# EAGLE design Rocketometer2148 MPU9150 No Oscillators Short (EAGLE 6.2)
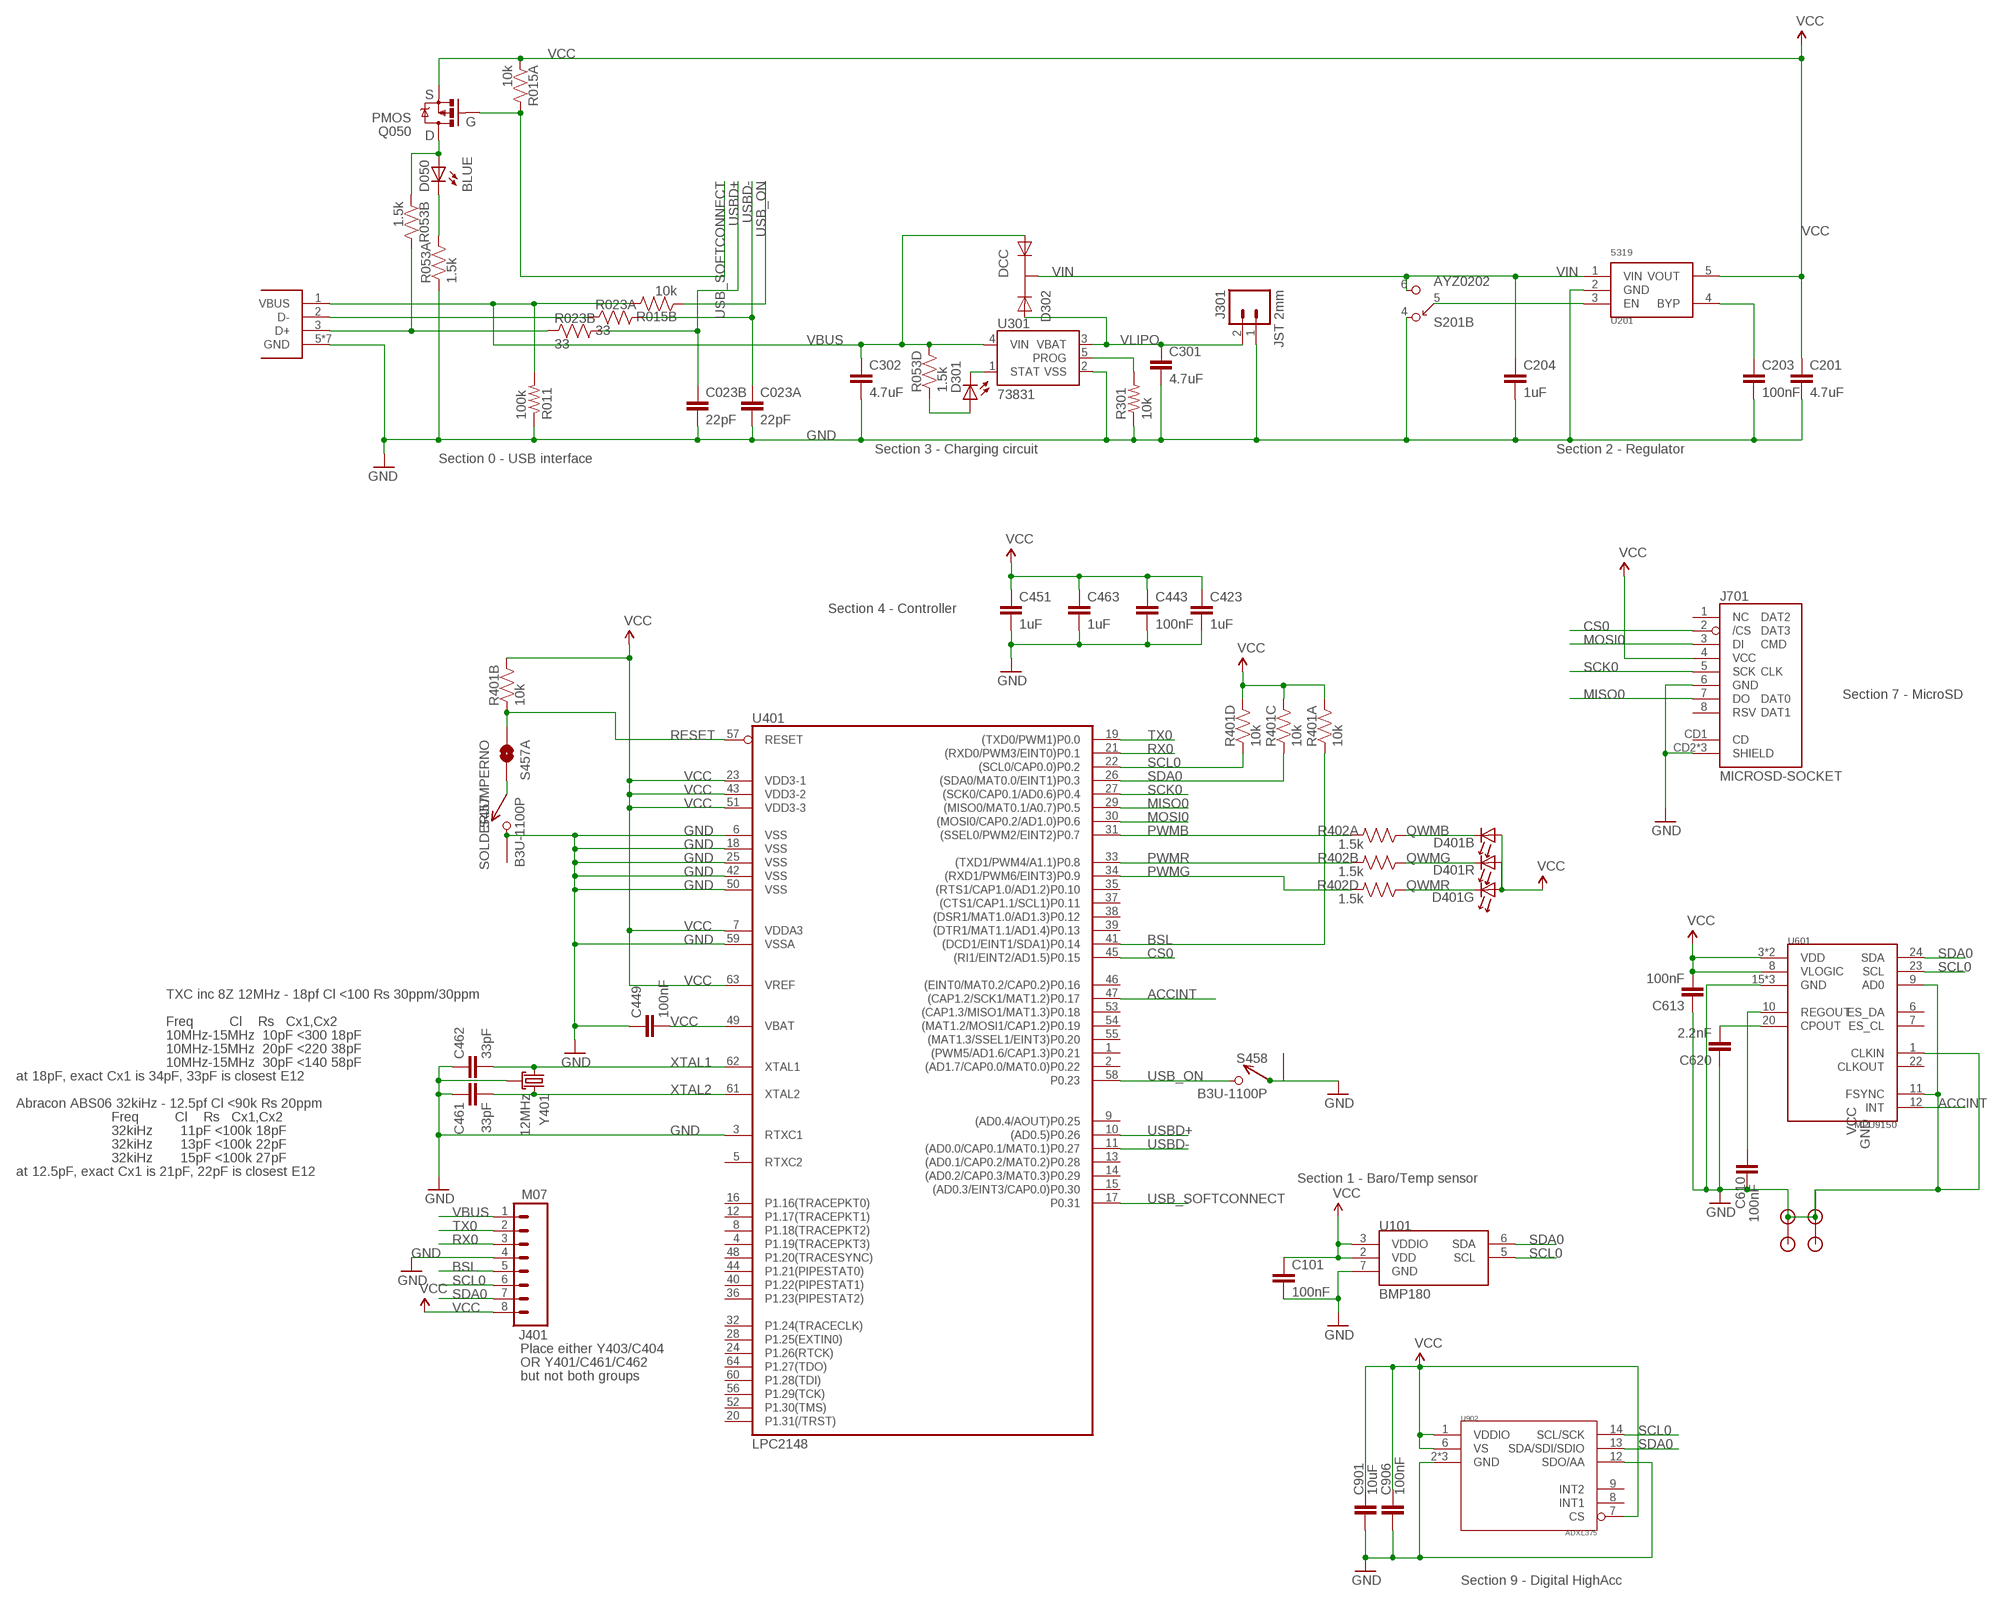
[diagram p0: schematic, sheet 1]

## Parts
C023  22pF  CKCM25  [CKCM25]
C101  100nF  CAP0402-CAP  [0402-CAP]
C201  4.7uF  CAP0402-CAP  [0402-CAP]
C203  100nF  CAP0402-CAP  [0402-CAP]
C204  1uF  CAP0402-CAP  [0402-CAP]
C301  4.7uF  CAP0402-CAP  [0402-CAP]
C302  4.7uF  CAP0402-CAP  [0402-CAP]
C423  1uF  CAP0402-CAP  [0402-CAP]
C443  100nF  CAP0402-CAP  [0402-CAP]
C449  100nF  CAP0402-CAP  [0402-CAP]
C451  1uF  CAP0402-CAP  [0402-CAP]
C461  33pF  CAP0402-CAP  [0402-CAP]
C462  33pF  CAP0402-CAP  [0402-CAP]
C463  1uF  CAP0402-CAP  [0402-CAP]
C610  100nF  CAP0402-CAP  [0402-CAP]
C613  100nF  CAP0402-CAP  [0402-CAP]
C620  2.2nF  CAP0402-CAP  [0402-CAP]
C901  10uF  CAP0603-CAP  [0603-CAP]
C906  100nF  CAP0402-CAP  [0402-CAP]
D050  BLUE  LED0603  [LED-0603]
D301  YELLOW  LED0603  [LED-0603]
D302  DCC  PMEG2005CT  [SOT-23-3]
D401  SMLP36RGB2W(R)  [SMLP36]
J001  USB_MICROB_JSTGCT  [USB_MICROB_3075]
J301  JST 2mm  M02-JST-2MM-SMT  [JST-2-SMD]
J401  M07  M081X08  [1X08]
J701  MICROSD-SOCKET  [MICROSD-SOCKET-PP]
JP1  STANDOFF  [STANDOFF]
JP2  STANDOFF  [STANDOFF]
JP4  STANDOFF  [STANDOFF]
JP5  STANDOFF  [STANDOFF]
Q050  PMOS  MOSFET-PCHANNELSMD  [SOT23-3]
R011  100k  RESISTOR0402-RES  [0402-RES]
R015  10k  RP2EXB24V  [CRA02]
R023  33  RP2EXB24V  [CRA02]
R053  1.5k  RP404  [CRA04]
R301  10k  RESISTOR0402-RES  [0402-RES]
R401  10k  RP404  [CRA04]
R402  1.5k  RP404  [CRA04]
S201  AYZ0202  [AYZ0202]
S457  B3U-1100P  [B3U-1100P]
S457A  SOLDERJUMPERNO  [SJ_2S-NO]
S458  B3U-1100P  [B3U-1100P]
U101  BMP180  [BMP180]
U201  5319  MIC5319D5  [SOT-23-5]
U301  73831  MCP73831  [SOT23-5]
U401  LPC2148  LPC213X  [SQFP-S-10X10-64]
U601  MPU9150  [LLGA24]
U902  ADXL375  [ADXL375]
Y401  12MHz  CX2520  [CRYSTAL_SMD_2MM_2_5MM]

## Nets
ACCINT: U401.47((CAP1.2/SCK1/MAT1.2)P0.17) U601.12(INT)
BSL: J401.5 R401.1 U401.41((DCD1/EINT1/SDA1)P0.14)
CONN_D+: J001.3(D+) R023.2 R053.7
CONN_D-: J001.2(D-) R023.1
CS0: J701.2(/CS) U401.45((RI1/EINT2/AD1.5)P0.15)
EN: S201.5 U201.3(EN)
GND [power]: C023.3 C023.4 C101.2 C201.2 C203.2 C204.2 C301.2 C302.2 C423.2 C443.2 C449.1 C451.2 C461.1 C462.1 C463.2 C610.2 C613.1 C620.1 C901.2 C906.2 J001.5(GND) J001.P$1(GND) J001.P$2(GND) J001.P$3(GND) J001.P$4(GND) J001.P$8(GND) J001.P$10(GND) J301.1 J401.4 J701.6(GND) J701.CD2(SHIELD) J701.GND1(SHIELD) J701.GND3(SHIELD) JP1.P$1 JP2.P$1 JP4.P$1 JP5.P$1 R011.1 R053.1 R301.1 S201.4 S457.P$2 S457.P$3 S458.P$1 S458.P$3 U101.7(GND) U201.2(GND) U301.2(VSS) U401.3(RTXC1) U401.6(VSS) U401.18(VSS) U401.25(VSS) U401.42(VSS) U401.50(VSS) U401.59(VSSA) U601.1(CLKIN) U601.9(AD0) U601.11(FSYNC) U601.15(GND) U601.17(GND) U601.18(GND) U902.2(GND) U902.4(GND) U902.5(GND) U902.12(SDO/AA) Y401.2(GND) Y401.4(GND)
MISO0: J701.7(DO) U401.29((MISO0/MAT0.1/A0.7)P0.5)
MOSI0: J701.3(DI) U401.30((MOSI0/CAP0.2/AD1.0)P0.6)
N$1: C620.2 U601.20(CPOUT)
N$2: R301.2 U301.5(PROG)
N$3: D301.A R053.4
N$4: D301.C U301.1(STAT)
N$6: D050.A Q050.3(D) R053.2
N$7: D050.C R053.8
N$9 [power]: S457.P$1 S457A.2
N$13: C610.1 U601.10(REGOUT)
N$17: C203.1 U201.4(BYP)
PWMB: R402.8 U401.31((SSEL0/PWM2/EINT2)P0.7)
PWMG: R402.5 U401.34((RXD1/PWM6/EINT3)P0.9)
PWMR: R402.7 U401.33((TXD1/PWM4/A1.1)P0.8)
QWMB: D401.1(B:C) R402.1
QWMG: D401.5(G:C) R402.4
QWMR: D401.3(R:C) R402.2
RESET [power]: R401.2 S457A.1 U401.57(RESET)
RX0: J401.3 U401.21((RXD0/PWM3/EINT0)P0.1)
SCK0: J701.5(SCK) U401.27((SCK0/CAP0.1/AD0.6)P0.4)
SCL0: J401.6 R401.4 U101.5(SCL) U401.22((SCL0/CAP0.0)P0.2) U601.23(SCL) U902.14(SCL/SCK)
SDA0: J401.7 R401.3 U101.6(SDA) U401.26((SDA0/MAT0.0/EINT1)P0.3) U601.24(SDA) U902.13(SDA/SDI/SDIO)
TX0: J401.2 U401.19((TXD0/PWM1)P0.0)
USB_ON: R015.2 S458.P$2 U401.58(P0.23)
USB_SOFTCONNECT: Q050.1(G) R015.4 U401.17(P0.31)
USBD+: C023.2 R023.3 U401.10((AD0.5)P0.26)
USBD-: C023.1 R023.4 U401.11((AD0.0/CAP0.1/MAT0.1)P0.27)
VBUS [power]: C302.1 D302.1(A1) J001.1(VBUS) J401.1 R011.2 R015.3 R053.5 U301.4(VIN)
VCC [power]: C101.1 C201.1 C423.1 C443.1 C449.2 C451.1 C463.1 C613.2 C901.1 C906.1 D401.2(B:A) D401.4(R:A) D401.6(G:A) J401.8 J701.4(VCC) Q050.2(S) R015.1 R401.5 R401.6 R401.7 R401.8 U101.2(VDD) U101.3(VDDIO) U201.5(VOUT) U401.7(VDDA3) U401.23(VDD3-1) U401.43(VDD3-2) U401.49(VBAT) U401.51(VDD3-3) U401.63(VREF) U601.3(VDD) U601.8(VLOGIC) U601.13(VDD) U902.1(VDDIO) U902.6(VS) U902.7(CS)
VIN: C204.1 D302.3(K) S201.6 U201.1(VIN)
VLIPO [power]: C301.1 D302.2(A2) J301.2 U301.3(VBAT)
XTAL1: C462.2 U401.62(XTAL1) Y401.1
XTAL2: C461.2 U401.61(XTAL2) Y401.3
Unconnected: J701.1(NC) J701.8(RSV) J701.CD1(CD) R053.3 R053.6 R402.3 R402.6 S201.1 S201.2 S201.3 U401.1((PWM5/AD1.6/CAP1.3)P0.21) U401.2((AD1.7/CAP0.0/MAT0.0)P0.22) U401.4(P1.19(TRACEPKT3)) U401.5(RTXC2) U401.8(P1.18(TRACEPKT2)) U401.9((AD0.4/AOUT)P0.25) U401.12(P1.17(TRACEPKT1)) U401.13((AD0.1/CAP0.2/MAT0.2)P0.28) U401.14((AD0.2/CAP0.3/MAT0.3)P0.29) U401.15((AD0.3/EINT3/CAP0.0)P0.30) U401.16(P1.16(TRACEPKT0)) U401.20(P1.31(/TRST)) U401.24(P1.26(RTCK)) U401.28(P1.25(EXTIN0)) U401.32(P1.24(TRACECLK)) U401.35((RTS1/CAP1.0/AD1.2)P0.10) U401.36(P1.23(PIPESTAT2)) U401.37((CTS1/CAP1.1/SCL1)P0.11) U401.38((DSR1/MAT1.0/AD1.3)P0.12) U401.39((DTR1/MAT1.1/AD1.4)P0.13) U401.40(P1.22(PIPESTAT1)) U401.44(P1.21(PIPESTAT0)) U401.46((EINT0/MAT0.2/CAP0.2)P0.16) U401.48(P1.20(TRACESYNC)) U401.52(P1.30(TMS)) U401.53((CAP1.3/MISO1/MAT1.3)P0.18) U401.54((MAT1.2/MOSI1/CAP1.2)P0.19) U401.55((MAT1.3/SSEL1/EINT3)P0.20) U401.56(P1.29(TCK)) U401.60(P1.28(TDI)) U401.64(P1.27(TDO)) U601.6(ES_DA) U601.7(ES_CL) U601.22(CLKOUT) U902.8(INT1) U902.9(INT2)

## Notes on the sheet
- S
- G
- D
- Section 0 - USB interface | Section 3 - Charging circuit | Section 2 - Regulator
- Section 4 - Controller
- Section 7 - MicroSD
- TXC inc 8Z 12MHz - 18pf Cl <100 Rs 30ppm/30ppm
- Freq         Cl    Rs   Cx1,Cx2
- 10MHz-15MHz  10pF <300 18pF
- 10MHz-15MHz  20pF <220 38pF
- 10MHz-15MHz  30pF <140 58pF
- at 18pF, exact Cx1 is 34pF, 33pF is closest E12
- Abracon ABS06 32kiHz - 12.5pf Cl <90k Rs 20ppm
- Freq         Cl    Rs   Cx1,Cx2
- 32kiHz       11pF <100k 18pF
- 32kiHz       13pF <100k 22pF
- 32kiHz       15pF <100k 27pF
- at 12.5pF, exact Cx1 is 21pF, 22pF is closest E12
- Section 1 - Baro/Temp sensor
- Place either Y403/C404
- OR Y401/C461/C462
- but not both groups
- Section 9 - Digital HighAcc

## Library data of the parts
C023 = KwanSystems:CKC; DIGIKEY: 445-1860-1-ND
C101 C203 C443 C449 C610 C613 = SparkFun:CAP: Capacitor Standard 0603 ceramic capacitor, and 0.1" leaded capacitor.; DIGIKEY: 445-1265-1-ND
C201 C301 C302 = SparkFun:CAP: Capacitor Standard 0603 ceramic capacitor, and 0.1" leaded capacitor.; DIGIKEY: 445-7395-1-ND
C204 C423 C451 C463 = SparkFun:CAP: Capacitor Standard 0603 ceramic capacitor, and 0.1" leaded capacitor.; DIGIKEY: 445-4114-1-ND
C461 C462 = SparkFun:CAP: Capacitor Standard 0603 ceramic capacitor, and 0.1" leaded capacitor.; DIGIKEY: 445-1241-1-ND
C620 = SparkFun:CAP: Capacitor Standard 0603 ceramic capacitor, and 0.1" leaded capacitor.; DIGIKEY: 445-1257-1-ND
C901 = SparkFun:CAP: Capacitor Standard 0603 ceramic capacitor, and 0.1" leaded capacitor.; DIGIKEY: 445-7486-1-ND
C906 = SparkFun-Passives:CAP: Capacitor Standard 0603 ceramic capacitor, and 0.1" leaded capacitor.; DIGIKEY: 445-1265-1-ND
D050 = SparkFun:LED: LEDs Standard schematic elements and footprints for 5mm, 3mm, 1206, and 0603 sized LEDs. 5mm - Spark Fun Electronics SKU : COM-00529 (and others); DIGIKEY: 350-2037-1-ND
D301 = SparkFun:LED: LEDs Standard schematic elements and footprints for 5mm, 3mm, 1206, and 0603 sized LEDs. 5mm - Spark Fun Electronics SKU : COM-00529 (and others); DIGIKEY: 350-2032-1-ND
D302 = KwanSystems:PMEG2005CT; DIGIKEY: 568-6500-1-ND
D401 = KwanSystems:SMLP36RGB2W(R); DIGIKEY: 846-1097-1-ND
J001 = KwanSystems:USB_MICROB_JST; DIGIKEY: 609-4616-2-ND
J301 = SparkFun:M02: Header 2 Standard 2-pin 0.1" header. Use with straight break away headers (SKU : PRT-00116), right angle break away headers (PRT-00553), swiss pins (PRT-00743), machine pins (PRT-00117), and female headers (PRT-00115). Molex polarized connector foot print use with SKU : PRT-08233 with associated crimp pins and housings.; DIGIKEY: 455-1749-1-ND
J401 = SparkFun-Connectors:M08: Header 8 Standard 8-pin 0.1" header. Use with straight break away headers (SKU : PRT-00116), right angle break away headers (PRT-00553), swiss pins (PRT-00743), machine pins (PRT-00117), and female headers (PRT-00115).; DIGIKEY: $NOPART
J701 = KwanSystems:MICROSD-SOCKET: microSD Socket Push-push type uSD socket. Digikey 101-00660-68-6-1-ND. tDoc lines correctly indicate media card edge positions when inserting (unlocked, locked, depressed).; DIGIKEY: 101-00581-59-1-ND
JP1 JP2 JP4 JP5 = KwanSystems:STANDOFF; DIGIKEY: $NOPART
Q050 = SparkFun:MOSFET-PCHANNEL; DIGIKEY: NTR1P02T1GOSCT-ND
R011 = SparkFun:RESISTOR: Resistor Basic schematic elements and footprints for 0603, 1206, and PTH resistors.; DIGIKEY: P100KLCT-ND
R015 = KwanSystems:RP2; DIGIKEY: Y5103CT-ND
R023 = KwanSystems:RP2
R053 R402 = KwanSystems:RP4; DIGIKEY: CRA4S81.5KCT-ND
R301 = SparkFun:RESISTOR: Resistor Basic schematic elements and footprints for 0603, 1206, and PTH resistors.; DIGIKEY: P10.0KLCT-ND
R401 = KwanSystems:RP4; DIGIKEY: CRA4S810KCT-ND
S201 = KwanSystems:AYZ0202; DIGIKEY: 401-2013-1-ND
S457 S458 = KwanSystems:B3U-1100P; DIGIKEY: SW1021CT-ND
S457A = SparkFun-Passives:SOLDERJUMPER: Solder Jumper Standard SMD solder jumper. Used to automate production. Two varients : Normally Open and Normally Closed are the same, but have different paste layers. NC will have a large amount of paste and should jumper during reflow.; DIGIKEY: $NOPART
U101 = KwanSystems:BMP180; DIGIKEY: 828-1027-1-ND
U201 = KwanSystems:MIC5319; DIGIKEY: 576-1910-1-ND
U301 = SparkFun:MCP73831: Microchip's MCP73831 Miniature single cell, fully integrated Li-Ion, Li-polymer charge management controller http://ww1.microchip.com/downloads/en/DeviceDoc/21984a.pdf; DIGIKEY: MCP73831T-2ACI/OTCT-ND
U401 = SparkFun:LPC213X: LPC213x Schematic element and footprint for NXP LPC213x. Spark Fun Electronics SKU : COM-00520; DIGIKEY: 568-1765-ND
U601 = KwanSystems:MPU9150; DIGIKEY: $NOPART
U902 = KwanSystems:ADXL375; DIGIKEY: ADXL375BCCZ-ND
Y401 = KwanSystems:CX2520; DIGIKEY: 887-1487-1-ND

## Net classes
0 default: width 0.152 mm, drill 0.33 mm, clearance 0.152 mm
1 power: width 0.152 mm, drill 0.33 mm, clearance 0.152 mm to class 0, clearance 0.152 mm
2 hv: width 0.152 mm, drill 0.33 mm, clearance 0.152 mm to class 0, clearance 0.152 mm to class 1, clearance 0.152 mm

## Board
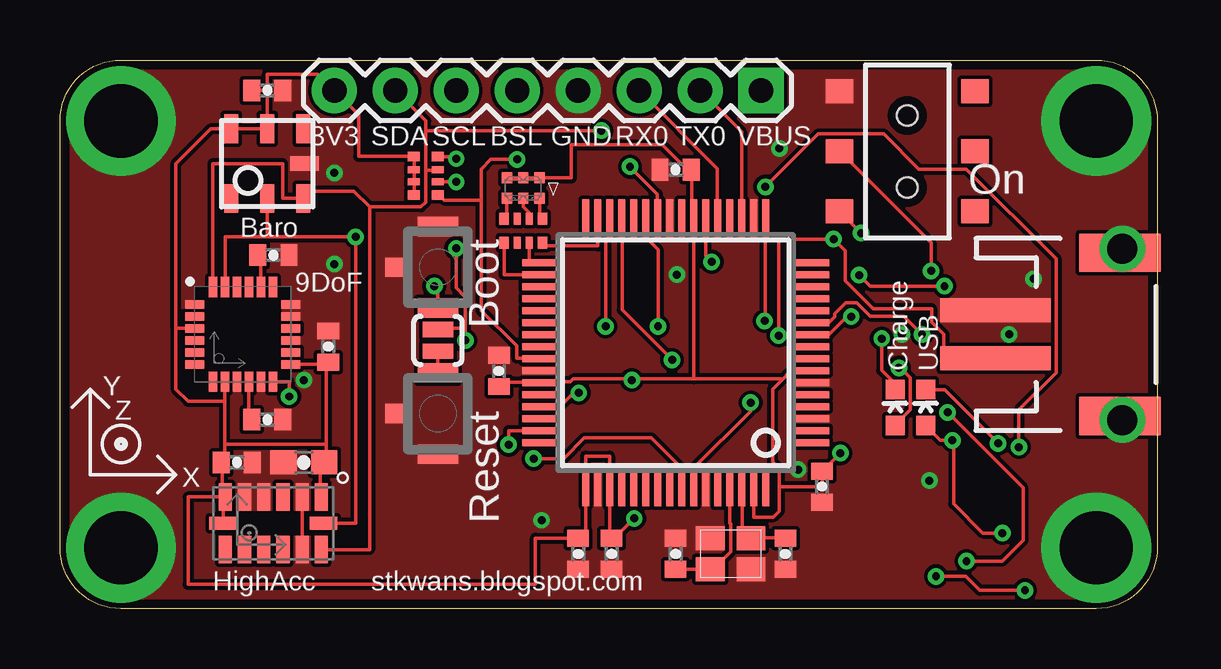
[diagram p1: board, top side]
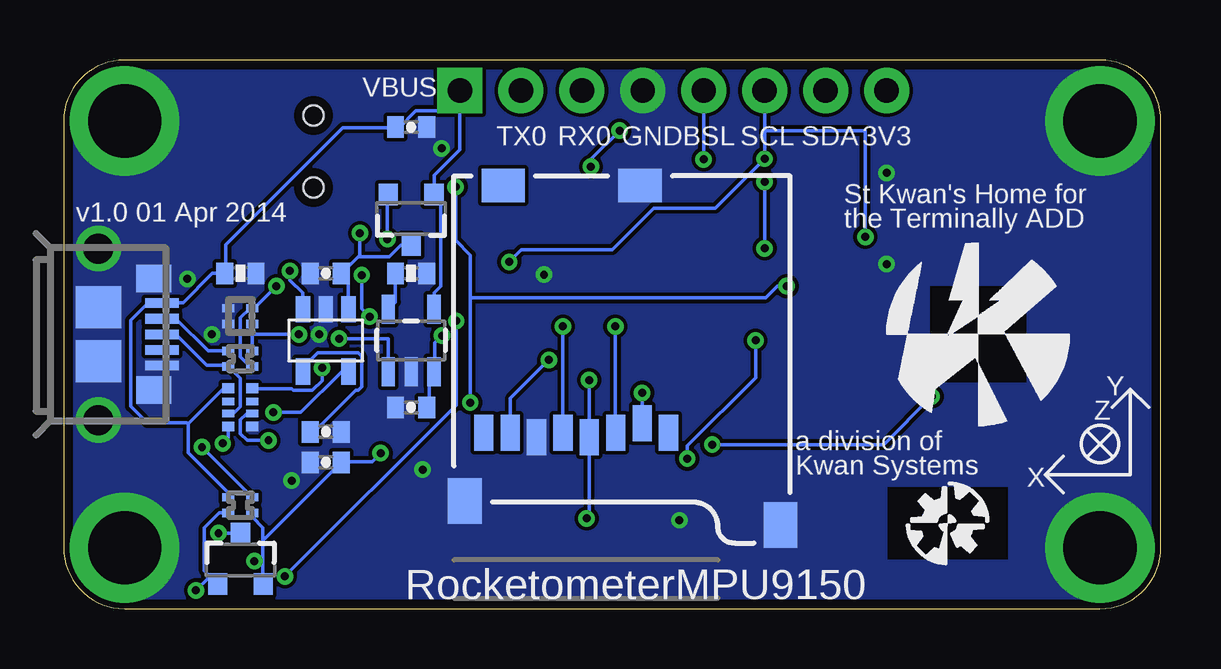
[diagram p2: board, bottom side, seen from below]

Size 45.72 x 22.86 mm. Coordinates in mm from the lower left corner, seen from the top.
Outline: 2.54,22.86 43.18,22.86 arc-90 45.72,20.32 45.72,2.54 arc-90 43.18,0 2.54,0 arc-90 0,2.54 0,20.32 arc-90 2.54,22.86
Copper layers (1*16): Top 0.0356mm / dielectric 1.5011mm / Bottom 0.0356mm
Design rules: minimum track width 6mil, minimum drill 13mil, track to track 6mil, track to pad 6mil, pad to pad 6mil, via to via 6mil, smd to smd 6mil, copper to edge 15mil, drill to drill 6mil, minimum pad ring 7mil, minimum via ring 7mil, stop-mask expansion 4mil, vias tented up to drill 14mil, thermal gap 10mil

### Footprints (pad centres in the part's own frame; a part is rotated, then mirrored left to right if it is on the bottom)
CKCM25 = smd 0.35 x 0.5: 1 -0.325,-0.5; 2 0.325,-0.5; 3 0.325,0.5; 4 -0.325,0.5
0402-CAP = smd 0.7 x 0.9: 1 -0.65,0; 2 0.65,0
0603-CAP = smd 1.1 x 1: 1 -0.85,0; 2 0.85,0
LED-0603 = smd 0.8 x 0.8: A 0,-0.75; C 0,0.75
SOT-23-3 = smd 0.9 x 0.8: 1 -1,0.95; 2 -1,-0.95; 3 1.1,0
SMLP36 = smd 0.45 x 0.45: 1 -0.675,0.425; 2 -0.675,-0.425; 5 0.675,0.425; 6 0.675,-0.425 | smd 0.4 x 0.45: 3 0,0.425; 4 0,-0.425
USB_MICROB_3075 = smd 0.4 x 1.4: 1 -1.3,4.1; 2 -0.65,4.1; 3 0,4.1; 4 0.65,4.1; 5 1.3,4.1 | smd 1.15 x 1.45: P$1 2.32,3.75; P$10 -2.32,3.75 | smd 1.75 x 1.9: P$2 1.125,1.45; P$8 -1.125,1.45 | drill 1.25 pad 1.9: P$3 -3.575,1.45; P$4 3.575,1.45
JST-2-SMD = smd 1 x 4.6: 1 -1,-3.7; 2 1,-3.7 | smd 1.6 x 3.4: NC1 -3.4,1.5; NC2 3.4,1.5
1X08 = drill 1.016 pad 1.88 square: 1 0,0 | drill 1.016 pad 1.88: 2 2.54,0; 3 5.08,0; 4 7.62,0; 5 10.16,0; 6 12.7,0; 7 15.24,0; 8 17.78,0
MICROSD-SOCKET-PP = smd 0.8 x 1.5: 1 -8.94,10.7; 2 -7.84,10.3; 3 -6.74,10.7; 4 -5.64,10.9; 5 -4.54,10.7; 6 -3.44,10.9; 7 -2.34,10.7; 8 -1.24,10.7 | smd 1.8 x 1.4: CD1 -2.05,0.4; CD2 -7.75,0.4 | smd 1.4 x 1.9: GND1 -13.6,14.55; GND3 -0.45,13.55
STANDOFF = drill 3.048 pad 4.572: P$1 0,0
SOT23-3 = smd 0.8 x 0.9: 1 -0.95,-1; 2 0.95,-1; 3 0,1.1
0402-RES = smd 0.7 x 0.9: 1 -0.65,0; 2 0.65,0
CRA02 = smd 0.35 x 0.5: 1 -0.325,-0.5; 2 0.325,-0.5; 3 0.325,0.5; 4 -0.325,0.5
CRA04 = smd 0.4 x 0.5: 1 -0.8,-0.5; 4 0.8,-0.5; 5 0.8,0.5; 8 -0.8,0.5 | smd 0.3 x 0.5: 2 -0.25,-0.5; 3 0.25,-0.5; 6 0.25,0.5; 7 -0.25,0.5
AYZ0202 = smd 1 x 1.15: 1 -2.5,2.825; 2 0,2.825; 3 2.5,2.825; 4 -2.5,-2.825; 5 0,-2.825; 6 2.5,-2.825 | hole 0.85: 1.5,0; -1.5,0
B3U-1100P = smd 0.8 x 1.7: P$1 -1.7,0; P$2 1.7,0 | smd 0.8 x 1.1: P$3 0,-1.65
SJ_2S-NO = smd 0.635 x 1.27: 1 -0.45,0; 2 0.45,0
BMP180 = smd 0.6 x 1.2: 1 1.5,1.45; 2 0,1.45; 3 -1.5,1.45; 4 -1.5,-1.45; 5 0,-1.45; 6 1.5,-1.45 | smd 1.2 x 0.6: 7 1.55,0
SOT-23-5 = smd 0.6 x 1.1: 1 -0.95,-1.3; 2 0,-1.3; 3 0.95,-1.3; 4 0.95,1.3; 5 -0.95,1.3
SOT23-5 = smd 0.55 x 1.2: 1 -0.95,-1.3; 2 0,-1.3; 3 0.95,-1.3; 4 0.95,1.3; 5 -0.95,1.3
SQFP-S-10X10-64 = smd 0.3 x 1.6: 1 -3.75,-5.6; 2 -3.25,-5.6; 3 -2.75,-5.6; 4 -2.25,-5.6; 5 -1.75,-5.6; 6 -1.25,-5.6; 7 -0.75,-5.6; 8 -0.25,-5.6; 9 0.25,-5.6; 10 0.75,-5.6; 11 1.25,-5.6; 12 1.75,-5.6; 13 2.25,-5.6; 14 2.75,-5.6; 15 3.25,-5.6; 16 3.75,-5.6; 33 3.75,5.6; 34 3.25,5.6; 35 2.75,5.6; 36 2.25,5.6; 37 1.75,5.6; 38 1.25,5.6; 39 0.75,5.6; 40 0.25,5.6; 41 -0.25,5.6; 42 -0.75,5.6; 43 -1.25,5.6; 44 -1.75,5.6; 45 -2.25,5.6; 46 -2.75,5.6; 47 -3.25,5.6; 48 -3.75,5.6 | smd 1.6 x 0.3: 17 5.6,-3.75; 18 5.6,-3.25; 19 5.6,-2.75; 20 5.6,-2.25; 21 5.6,-1.75; 22 5.6,-1.25; 23 5.6,-0.75; 24 5.6,-0.25; 25 5.6,0.25; 26 5.6,0.75; 27 5.6,1.25; 28 5.6,1.75; 29 5.6,2.25; 30 5.6,2.75; 31 5.6,3.25; 32 5.6,3.75; 49 -5.6,3.75; 50 -5.6,3.25; 51 -5.6,2.75; 52 -5.6,2.25; 53 -5.6,1.75; 54 -5.6,1.25; 55 -5.6,0.75; 56 -5.6,0.25; 57 -5.6,-0.25; 58 -5.6,-0.75; 59 -5.6,-1.25; 60 -5.6,-1.75; 61 -5.6,-2.25; 62 -5.6,-2.75; 63 -5.6,-3.25; 64 -5.6,-3.75
LLGA24 = smd 0.8 x 0.35: 1 -2,1.25; 2 -2,0.75; 3 -2,0.25; 4 -2,-0.25; 5 -2,-0.75; 6 -2,-1.25; 13 2,-1.25; 14 2,-0.75; 15 2,-0.25; 16 2,0.25; 17 2,0.75; 18 2,1.25 | smd 0.35 x 0.85: 7 -1.25,-1.975; 8 -0.75,-1.975; 9 -0.25,-1.975; 10 0.25,-1.975; 11 0.75,-1.975; 12 1.25,-1.975; 19 1.25,1.975; 20 0.75,1.975; 21 0.25,1.975; 22 -0.25,1.975; 23 -0.75,1.975; 24 -1.25,1.975
ADXL375 = smd 0.55 x 1.145: 1 2,1.097; 2 1.2,1.097; 3 0.4,1.097; 4 -0.4,1.097; 5 -1.2,1.097; 6 -2,1.097; 8 -2,-1.097; 9 -1.2,-1.097; 10 -0.4,-1.097; 11 0.4,-1.097; 12 1.2,-1.097; 13 2,-1.097 | smd 1.145 x 0.55: 7 -2.098,0; 14 2.098,0
CRYSTAL_SMD_2MM_2_5MM = smd 1.2 x 1: 1 -0.85,-0.65; 2 0.85,-0.65; 3 0.85,0.65; 4 -0.85,0.65

### Placement (x,y rotation side)
C023  38.35,12.19 90 bottom
C101  8.64,21.59 0 top
C201  34.8,6.1 180 bottom
C203  34.8,7.37 0 bottom
C204  34.8,13.97 180 bottom
C301  31.24,8.38 180 bottom
C302  31.24,20.07 0 bottom
C423  25.65,18.29 180 top
C443  18.29,9.91 90 top
C449  21.59,2.29 90 top
C451  22.99,2.29 270 top
C461  25.65,2.29 270 top
C462  30.23,2.29 90 top
C463  31.75,5.08 270 top
C610  8.64,7.87 0 top
C613  11.18,10.92 270 top
C620  8.89,14.73 180 top
C901  10.16,6.1 180 top
C906  7.37,6.1 0 top
D050  36.07,8.38 0 top
D301  34.8,8.38 0 top
D302  31.24,16.26 270 bottom
D401  19.3,17.53 180 top
J001  45.72,11.43 270 bottom
J301  42.67,11.43 270 top
J401  29.21,21.59 180 top
J701  29.46,18.03 180 bottom
JP1  2.54,2.54 0 top
JP2  2.54,20.32 0 top
JP4  43.18,2.54 0 top
JP5  43.18,20.32 0 top
Q050  38.35,2.03 0 bottom
R011  38.35,13.97 180 bottom
R015  38.35,4.32 90 bottom
R023  38.35,10.41 270 bottom
R053  38.35,8.38 90 bottom
R301  31.24,13.97 180 bottom
R401  15.24,18.03 90 top
R402  19.3,15.75 180 top
S201  35.31,19.05 270 top
S457  15.75,8.13 270 top
S457A  15.75,11.18 270 top
S458  15.75,14.22 270 top
U101  8.64,18.54 0 top
U201  34.8,11.18 180 bottom
U301  31.24,11.18 0 bottom
U401  25.65,10.67 90 top
U601  7.62,11.43 0 top
U902  8.89,3.56 0 top
U$4  [AXES]  1.27,5.59 0 top
U$5  [KWAN_ACC]  7.62,11.43 0 bottom
U$6  [OSHW_ACC]  8.89,3.56 0 bottom
Y401  27.94,2.29 180 top

### Tracks (layer width: path | path; a pad name or v marks a point on that pad's centre or on a via)
ACCINT  (via drill 0.33)
  Top 0.152: U401.47 18.69,7.42 v18.69,6.83 | U601.12 9.55,9.46 v9.55,8.84
  Bottom 0.152: v9.55,8.84 11.56,6.83 v18.69,6.83
BSL  (via drill 0.33)
  Top 0.152: 17.55,17.02 17.55,12.42 19.02,10.95 19.02,10.44 20.04,10.44 U401.41 | 17.55,17.02 17.55,18.31 17.96,18.72 v19.05,18.72 | R401.1 15.8,17.22 16,17.02 17.55,17.02
  Bottom 0.152: v19.05,18.72 J401.5
CONN_D+
  Bottom 0.152: R053.7 38.84,8.15 38.61,8.15 38.35,8.41 38.35,9.6 38.84,10.08 R023.2 38.91,10.13 39.75,10.13 41.05,11.43 J001.3
CONN_D-
  Bottom 0.152: R023.1 38.86,10.74 39.7,10.74 41.02,12.06 41.6,12.06 J001.2
CS0  (via drill 0.33)
  Top 0.152: v21.61,8.99 21.41,8.99 20.85,8.43 20.07,8.43 U401.45
  Bottom 0.152: v21.61,8.99 21.61,7.75 J701.2
EN  (via drill 0.33)
  Top 0.152: v36.3,14.07 36.3,15.24 S201.5
  Bottom 0.152: v36.3,14.07 36.3,13.69 35.76,13.16 35.76,12.5 U201.3
GND  (via drill 0.33)
  Top 0.152: U601.1 | 31.27,7.9 U401.3 | U902.2 U902.12
  other vias: 35.08,11.43 39.55,11.43 29.97,19.18 40.56,13.74 36.22,5.33 25.7,13.92 30.76,5.79 11.43,14.35 10.16,9.53 11.43,18.16 20.07,3.68
  pour Bottom (no thermals): 2.54,22.86 43.18,22.86 arc-90 45.72,20.32 45.72,2.54 arc-90 43.18,0 2.54,0 arc-90 0,2.54 0,20.32 arc-90
  pour Top (no thermals): 2.54,22.86 43.18,22.86 arc-90 45.72,20.32 45.72,2.54 arc-90 43.18,0 2.54,0 arc-90 0,2.54 0,20.32 arc-90
MISO0  (via drill 0.33)
  Top 0.152: v25.5,10.36 23.42,12.45 23.42,16.26 U401.29
  Bottom 0.152: v25.5,10.36 27.1,8.76 27.1,7.34 J701.7
MOSI0  (via drill 0.33)
  Top 0.152: v22.73,11.76 22.73,15.32 22.89,15.47 22.89,16.26 U401.30
  Bottom 0.152: v22.73,11.76 22.73,7.34 J701.3
N$1
  Top 0.152: U601.20 8.36,13.41 8.36,14.63 8.26,14.73 C620.2
N$2
  Bottom 0.152: R301.2 31.9,13.97 31.9,12.78 32.18,12.5 U301.5
N$3  (via drill 0.33)
  Top 0.152: v34.95,10.03 35.03,10.03 35.43,9.63 35.43,8.28 34.8,7.64 D301.A
  Bottom 0.152: v34.95,10.03 34.95,9.5 35.36,9.09 36.14,9.09 36.22,9.17 R053.4
N$4  (via drill 0.33)
  Top 0.152: D301.C 34.8,9.37 34.24,9.93 v34.24,11.25
  Bottom 0.152: 32.21,9.88 U301.1 32.19,11.25 v34.24,11.25
N$6  (via drill 0.33)
  Top 0.152: D050.A 36.68,7.01 v37.19,7.01 37.24,6.96 37.24,4.37 38.46,3.15 v39.27,3.15
  Bottom 0.152: v37.19,7.01 38.08,7.01 38.35,7.29 38.35,7.87 38.1,8.13 37.87,8.13 R053.2 | v39.27,3.15 38.35,3.15 Q050.3
N$7  (via drill 0.33)
  Top 0.152: v39.09,6.88 36.85,9.12 36.07,9.12 D050.C
  Bottom 0.152: v39.09,6.88 38.86,7.11 38.86,7.57 R053.8
N$9
  Top 0.152: S457.P$1 S457A.2
N$13
  Top 0.152: U601.10 7.87,7.98 7.98,7.87 C610.1
N$17
  Bottom 0.152: C203.1 35.28,7.37 33.55,9.09 33.45,9.09 33.3,9.25 33.3,10.52 33.45,10.67 35.13,10.67 35.74,10.06 35.74,9.88 U201.4
PWMB
  Top 0.152: U401.31 22.4,15.11 20.24,15.11 R402.8
PWMG
  Top 0.152: U401.34 18.5,13.92 R402.5
PWMR
  Top 0.152: U401.33 19.55,14.42 R402.7
QWMB
  Top 0.152: D401.1 19.99,16.36 R402.1
QWMG
  Top 0.152: D401.5 18.62,17.09 18.62,16.36 18.52,16.26 R402.4
QWMR
  Top 0.152: D401.3 19.3,16.74 19.53,16.51 19.53,16.26 R402.2
RESET  (via drill 0.33)
  Top 0.152: v16.51,17.78 R401.2 | v16.51,15.01 16.51,13.36 16.89,12.98 16.89,11.68 | S457A.1 15.81,11.68 16.89,11.68 | U401.57 25.88,5.08 25.88,5.87 24.64,7.11 21.84,7.11 20.98,6.25 v19.74,6.25 | 16.89,11.68 v16.89,11.18
  Bottom 0.152: v16.51,15.01 v16.51,17.78 | v19.74,6.25 19.74,6.78 16.89,9.63 v16.89,11.18
RX0
  Top 0.152: J401.3 27.38,18.34 27.38,16.28 U401.21
SCK0  (via drill 0.33)
  Top 0.152: v24.92,11.76 24.92,14.96 24.41,15.47 24.41,16.26 U401.27
  Bottom 0.152: v24.92,11.76 J701.5
SCL0  (via drill 0.33)
  Top 0.152: U601.23 6.88,13.41 6.88,15.49 8.64,15.49 | v16.51,18.75 16.43,18.82 R401.4 | U401.22 26.9,16.26 26.9,14.71 v27.15,14.45 | U101.5 8.64,15.49 | U902.14 12.32,3.56 v12.32,15.49 8.64,15.49
  Bottom 0.152: J401.6 16.51,19.91 | v27.15,14.45 26.64,14.96 22.86,14.96 21.13,16.69 18.57,16.69 v16.51,18.75 16.51,19.81 16.51,19.91 | v12.32,15.49 12.32,19.91 16.51,19.91
SDA0  (via drill 0.33)
  Top 0.152: 15.24,18.26 15.24,16.94 15.04,16.74 12.9,16.74 | R401.3 15.72,18.26 15.24,18.26 | 6.35,13.41 U601.24 6.37,18.54 9.27,18.54 9.27,17.09 U101.6 10.14,17.4 12.24,17.4 12.9,16.74 | U902.13 12.9,2.46 12.9,16.74 | v23.75,18.41 24.89,17.27 U401.26 | 15.24,19.91 v22.55,19.91 | 15.24,18.26 15.24,19.3 15.24,19.91 | 15.24,19.91 15.24,20.32 J401.7
  Bottom 0.152: v23.75,18.41 23.75,18.72 v22.55,19.91
TX0
  Top 0.152: J401.2 28.4,19.86 U401.19
USB_ON  (via drill 0.33)
  Top 0.152: v39.95,6.73 39.95,8.28 41.5,9.83 41.5,14.58 37.77,18.31 35.79,18.31 34.31,19.79 31.6,19.79 v29.39,17.58 | v28.78,8.59 28.78,8.23 26.42,5.87 26.42,5.08 U401.58 | S458.P$2 15.75,13.28 v15.6,13.44
  Bottom 0.152: v39.95,6.73 37.87,4.65 R015.2 | v29.39,17.58 29.39,15.34 28.78,14.73 28.78,12.95 | v28.78,8.59 28.78,12.95 | v15.6,13.44 15.98,13.44 16.46,12.95 28.78,12.95
USB_SOFTCONNECT  (via drill 0.33)
  Top 0.152: v29.36,11.99 29.39,12.01 29.39,16.26 U401.17 | v36.5,1.35 37.74,1.35 38.33,0.76 v40.21,0.76
  Bottom 0.152: R015.4 38.86,3.99 39.24,3.99 39.85,3.38 39.85,1.57 39.32,1.04 Q050.1 39.67,1.29 v40.21,0.76 | v29.36,11.99 29.36,8.48 v36.5,1.35
USBD+  (via drill 0.33)
  Top 0.152: v36.85,13.44 33.76,13.44 v33.3,13.89 | v32.97,12.17 32.79,12.17 32.05,11.43 31.27,11.43 U401.10
  Bottom 0.152: R023.3 37.87,10.11 37.97,10.11 38.35,10.49 38.35,12.12 37.97,12.5 37.87,12.5 C023.2 37.8,12.55 37.74,12.55 v36.85,13.44 | v33.3,13.89 33.3,12.5 v32.97,12.17
USBD-  (via drill 0.33)
  Top 0.152: v35.92,11.43 35.15,12.19 33.76,12.19 33.2,12.75 32.74,12.75 32.28,12.29 32.28,12.17 32.05,11.94 31.27,11.94 U401.11
  Bottom 0.152: 37.87,11.43 37.87,11.86 C023.1 | 37.87,11.43 37.87,10.74 R023.4 | v35.92,11.43 37.87,11.43
VBUS
  Bottom 0.152: 40.54,7.7 40.54,6.5 38.86,4.83 38.86,4.65 R015.3 | 40.54,7.7 39.06,9.17 38.86,9.17 R053.5 | 40.54,7.7 40.59,7.75 42.24,7.75 42.93,8.43 42.93,12.01 42.24,12.7 41.68,12.7 J001.1 41.6,12.75 40.74,12.75 39.52,13.97 R011.2 38.96,14.02 38.96,15.16 34.09,20.04 31.95,20.04 C302.1 31.73,20.07 31.04,20.75 29.26,20.75 J401.1 29.21,19.13 30.28,18.06 30.28,17.27 D302.1 30.25,17.2 30,16.94 30,13.44 30.28,13.16 30.28,12.5 U301.4
VCC  (via drill 0.33)
  Top 0.152: v36.98,8.18 40.13,5.03 40.13,2.85 39.27,1.98 v37.77,1.98 | 22.91,5.05 U401.51 | C463.1 | 30.07,9.53 29.69,9.14 29.69,6.12 29.97,5.84 29.97,5.08 | 30.07,9.53 30.45,9.91 31.24,9.91 U401.7 | 26.42,9.58 30.02,9.58 30.07,9.53 | 26.42,9.58 23.82,9.58 | 23.82,9.58 21.39,9.58 21.26,9.45 20.12,9.45 U401.43 18.29,9.42 C443.1 | v23.82,9.53 23.82,9.58 | v32.51,6.48 31.8,5.77 C463.1 | R401.8 14.76,17.25 14.76,17.78 R401.7 14.76,17.86 14.76,18.26 R401.6 14.76,18.34 14.76,18.82 R401.5 | D401.6 18.64,17.93 19.3,17.93 D401.4 19.36,17.93 19.96,17.93 D401.2 | 20.04,17.91 D401.2 | R401.5 14.68,18.85 12.45,18.85 12.45,20.57 J401.8 10.74,22.28 8.64,22.28 8.64,21.59 | 14.81,18.87 R401.5 | 6.86,6.86 6.86,6.45 6.76,6.35 | 6.86,6.86 6.86,8.64 | 6.86,8.64 6.86,9.45 U601.8 | 11.1,10.19 U601.13 | 11.1,10.19 C613.2 | C901.1 10.85,6.35 10.85,4.7 10.87,4.67 U902.1 | 10.79,6.4 C901.1 | 7.87,21.59 C101.1 | 6.81,4.65 6.81,3.56 U902.7 | U902.6 6.81,4.65 | 7.92,21.64 C101.1 | U601.3 4.83,11.68 | 6.86,8.64 5.33,8.64 4.83,9.14 4.83,11.68 | C906.1 6.76,6.35 | D401.2 21.31,17.95 21.31,19.33 25.09,19.33 26.11,18.31 26.24,18.31 C423.1 26.31,18.29 26.31,16.36 U401.23 26.42,16.27 26.42,9.58 | 29.97,5.08 29.97,4.06 29.72,3.81 28.9,3.81 U401.63 | C463.1 31.75,5.08 29.97,5.08 | 8.64,21.59 U101.2 U101.3 6.28,19.99 4.83,18.54 4.83,11.68 | C101.1 8.64,21.59 | 6.76,6.35 6.76,4.65 | 6.76,4.65 6.81,4.65 | U401.51 22.9,2.94 C451.1 23.1,2.94 v23.93,3.76 | 11.1,10.19 11.1,6.86 | 11.1,6.86 11.1,6.35 C901.1 | 6.86,6.86 11.1,6.86 | 6.76,4.65 5.33,4.65 5.33,1.02 19.81,1.02 19.81,2.94 C449.2 21.9,2.94 U401.49 21.9,6.35 22.9,6.35 U401.51
  Bottom 0.152: 37.41,1.98 37.41,1.04 Q050.2 | 37.41,1.98 37.41,2.9 | 37.41,2.9 37.41,3.38 37.85,3.81 R015.1 | 37.41,2.9 37.36,2.9 34.16,6.1 C201.1 34.09,6.12 32.87,6.12 v32.51,6.48 | v36.98,8.18 35.84,8.18 34.16,9.86 33.86,9.86 U201.5 | v37.77,1.98 37.41,1.98 | v23.93,3.76 23.82,3.86 23.82,7.11 J701.4 23.82,7.19 v23.82,9.53
VIN  (via drill 0.33)
  Top 0.152: v33.38,15.65 32.49,16.54 S201.6
  Bottom 0.152: 33.38,14.66 33.45,14.66 34.14,13.97 C204.1 34.14,13.92 33.86,13.64 33.86,12.5 U201.1 | 33.38,14.66 32.16,14.66 31.67,15.14 31.24,15.14 D302.3 | 33.38,14.66 v33.38,15.65
VLIPO  (via drill 0.33)
  Top 0.152: J301.2 37.82,10.44 37.8,10.41 36.83,10.41 36.83,11.43 36.32,11.94 36.32,12.5 33.88,12.5 32.72,13.66 32.72,14.91 v32.23,15.39 29.95,15.39 v29.95,11.38 29.9,11.4
  Bottom 0.152: C301.1 30.48,8.49 30.48,9.68 arc90 30.3,9.86 U301.3 30.25,9.93 30.25,11.07 v29.95,11.38 | 32.18,17.37 32.18,17.27 D302.2 32.23,17.2 v32.23,15.39
XTAL1
  Top 0.152: 30.28,3 C462.2 28.8,2.95 Y401.1 28.78,3.02 28.42,3.38 28.42,5.05 U401.62
XTAL2
  Top 0.152: C461.2 25.65,1.65 27.08,1.65 Y401.3 27.15,1.68 27.25,1.68 27.94,2.36 27.94,3.53 27.91,3.56 27.91,5.05 U401.61

### Text on the board
tPlace: 3V3 | SDA | SCL | BSL | GND | RX0 | TX0 | VBUS | On | Baro | 9DoF | Boot | Charge | USB | Reset | HighAcc | stkwans.blogspot.com
bPlace: VBUS | 3V3 | SDA | SCL | BSL | GND | RX0 | TX0 | St Kwan's Home for | the Terminally ADD | v1.0 01 Apr 2014 | a division of | Kwan Systems | RocketometerMPU9150